# Altium schematic sheet Sistema.SchDoc
size A4; SheetNumber: 1; SheetTotal: 5
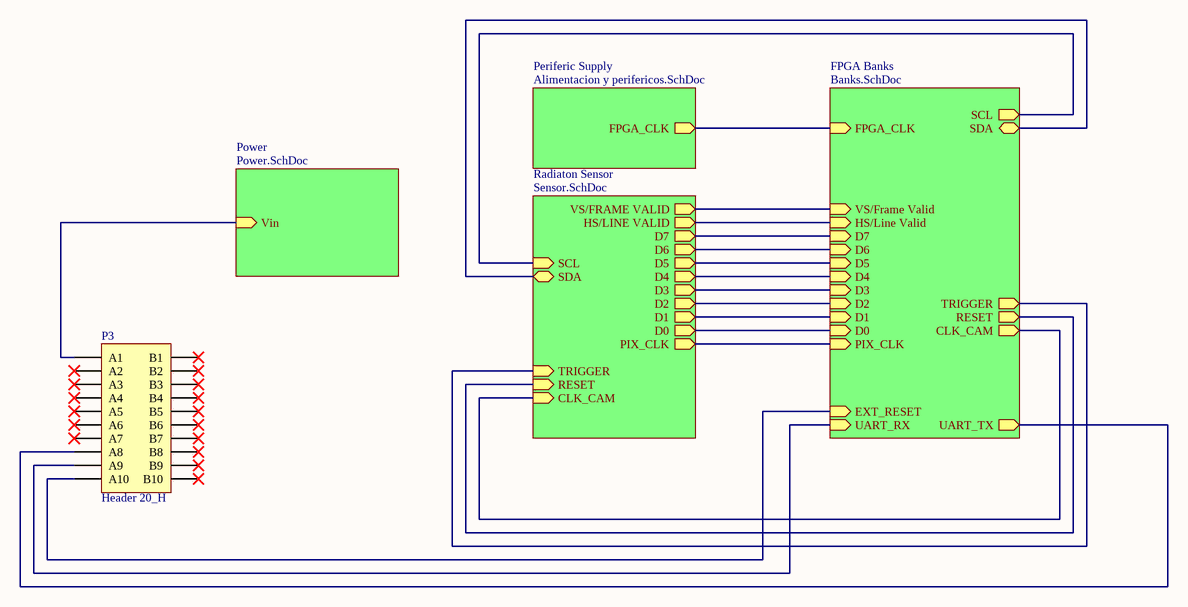
[diagram p0: Sistema.SchDoc]

## Parts
P3  Header 20_H  [P_DIN41612-20-H]

## Sub-sheets
FPGA Banks = Banks.SchDoc: FPGA_CLK (in), SCL (out), SDA (bidir), VS/Frame Valid (in), HS/Line Valid (in), D7 (in), D6 (in), D5 (in), D4 (in), D3 (in), D2 (in), D1 (in), PIX_CLK (in), CLK_CAM (out), D0 (in), TRIGGER (out), RESET (out), EXT_RESET (in), UART_TX (out), UART_RX (in)
Periferic Supply = Alimentacion y perifericos.SchDoc: FPGA_CLK (out)
Power = Power.SchDoc: Vin (in)
Radiaton Sensor = Sensor.SchDoc: VS/FRAME VALID (out), SDA (bidir), SCL (in), RESET (in), PIX_CLK (out), HS/LINE VALID (out), D7 (out), D6 (out), D5 (out), D4 (out), D3 (out), D2 (out), D1 (out), D0 (out), CLK_CAM (in), TRIGGER (in)

## Nets
NetP3_A1: P3.A1 ; sheet Power/Vin
NetP3_A8: P3.A8 ; sheet FPGA Banks/UART_TX
NetP3_A9: P3.A9 ; sheet FPGA Banks/UART_RX
NetP3_A10: P3.A10 ; sheet FPGA Banks/EXT_RESET
(unnamed): sheet Periferic Supply/FPGA_CLK, sheet FPGA Banks/FPGA_CLK
(unnamed): sheet FPGA Banks/SCL, sheet Radiaton Sensor/SCL
(unnamed): sheet FPGA Banks/SDA, sheet Radiaton Sensor/SDA
(unnamed): sheet FPGA Banks/VS/Frame Valid, sheet Radiaton Sensor/VS/FRAME VALID
(unnamed): sheet FPGA Banks/HS/Line Valid, sheet Radiaton Sensor/HS/LINE VALID
(unnamed): sheet FPGA Banks/D7, sheet Radiaton Sensor/D7
(unnamed): sheet FPGA Banks/D6, sheet Radiaton Sensor/D6
(unnamed): sheet FPGA Banks/D5, sheet Radiaton Sensor/D5
(unnamed): sheet FPGA Banks/D4, sheet Radiaton Sensor/D4
(unnamed): sheet FPGA Banks/D3, sheet Radiaton Sensor/D3
(unnamed): sheet FPGA Banks/D2, sheet Radiaton Sensor/D2
(unnamed): sheet FPGA Banks/D1, sheet Radiaton Sensor/D1
(unnamed): sheet FPGA Banks/PIX_CLK, sheet Radiaton Sensor/PIX_CLK
(unnamed): sheet FPGA Banks/CLK_CAM, sheet Radiaton Sensor/CLK_CAM
(unnamed): sheet FPGA Banks/D0, sheet Radiaton Sensor/D0
(unnamed): sheet FPGA Banks/TRIGGER, sheet Radiaton Sensor/TRIGGER
(unnamed): sheet FPGA Banks/RESET, sheet Radiaton Sensor/RESET

Not connected (* = marked no-connect by the designer): P3 A2* A3* A4* A5* A6* A7* B1* B2* B3* B4* B5* B6* B7* B8* B9* B10*

## Library data of the parts
P3 = P_Conector_20_H: Conector 20 Position Din Connector Plug, Male Pins Gold Through Hole, Right Angle; Manufacturer: HARTING Technology; Manufacturer Part Number: 09242206825; Current Rating: 2A; Gender: Female; Connector Type: Receptacle; Number of Positions: 20; Pitch: 2.54mm; Tail Length: 4.5mm; Mounting Technology: Through Hole; Contact Material: Copper Alloy; Contact Plating: Gold; Insulation Material: Glass; Housing Material: Thermoplastic; Shell Size: 3B; Packaging: Bulk; Package Quantity: 20; Number of Rows: 2; Termination: Solder; Number of Contacts: 20; Orientation: Straight; Series: DIN 41612; Lead Free: Lead Free; Flammability Rating: UL94 V-0; RoHS Compliant: Yes; ComponentLink1URL: https://datasheet.ciiva.com/11731/0900766b811d3497-11731844.pdf?src-supplier=Rs; ComponentLink1Description: https://datasheet.ciiva.com/11731/0900766b811d3497-11731844.pdf?src-supplier=Rs; Supplier 1: Mouser; Supplier Part Number 1: 617-09-24-220-6825; RoHS: Yes; Category: DIN 41612 Connectors; Stock 1: 166; Pricing 1: 1=4,87, 10=4,27, 50=4,27, 100=3,55, 1000=2,94, 10000=2,74 (USD); Value: Header 20_H